# Altium schematic sheet ESPBoard.SchDoc
size A4; SheetNumber: 1; SheetTotal: 1
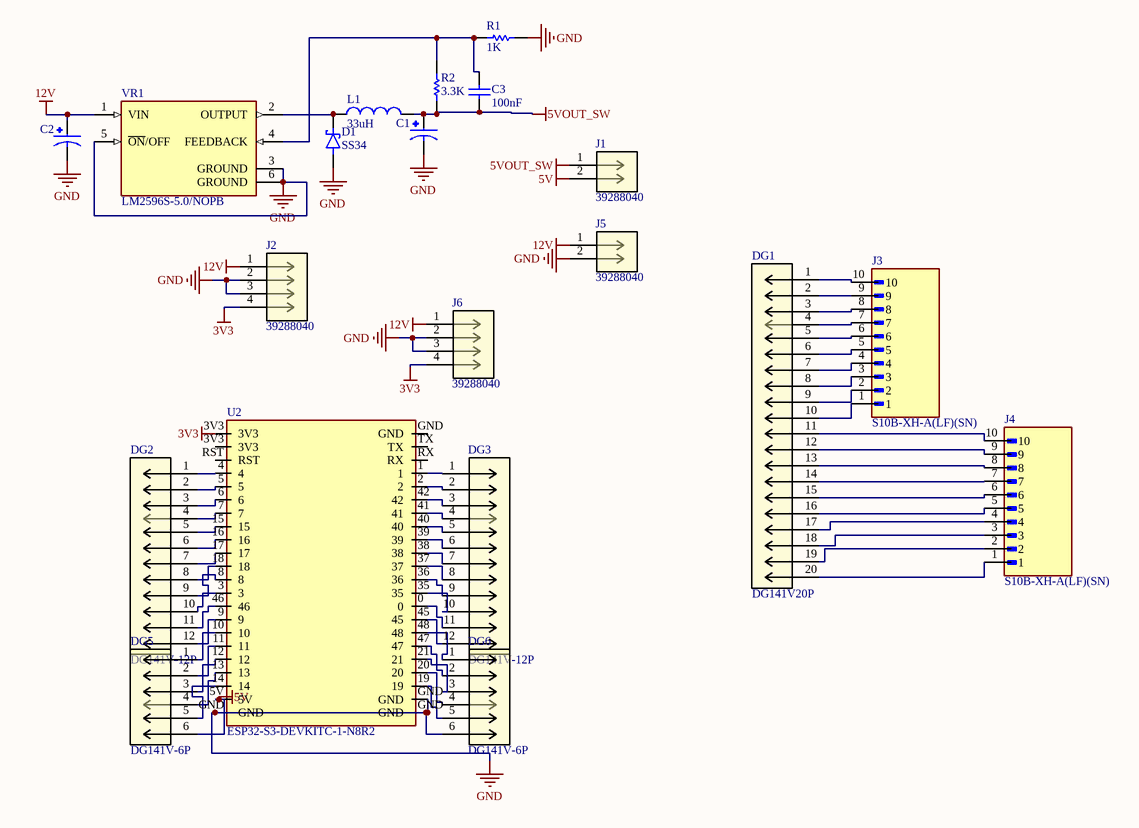
[diagram p0: ESPBoard.SchDoc]

## Parts
C1  EEUFR1V101B  [220uF]  (value not drawn)
C2  EEUFR1V101B  [100uF]  (value not drawn)
C3  value 100nF  [CAP0805R]  (hidden comment: Capacitor)
D1  SS34  [DIOM7959X265N]
DG1  DG141V20P  [141V-20P]
DG2  DG141V-12P  [141V-12P]
DG3  DG141V-12P  [141V-12P]
DG5  DG141V-6P  [141V-6P]
DG6  DG141V-6P  [141V-6P]
J1  39288040  [5566-02_MOL]
J2  39288040  [5566-04_MOL]
J3  S10B-XH-A(LF)(SN)  [JST_S10B-XH-A(LF)(SN)]
J4  S10B-XH-A(LF)(SN)  [JST_S10B-XH-A(LF)(SN)]
J5  39288040  [5566-02_MOL]
J6  39288040  [5566-04_MOL]
L1  value 33uH  [SC1280S-33uH]  (hidden comment: Inductor)
R1  value 1K  [RES0805W]  (hidden comment: Resistor)
R2  value 3.3K  [RES0805W]  (hidden comment: Resistor)
U2  ESP32-S3-DEVKITC-1-N8R2  [ESP32-S3-DEVKITC-1]
VR1  LM2596S-5.0/NOPB  [VREG_LM2596S-5.0/NOPB]

## Nets
3V3: J2.4 J6.4 U2.3V3
5V: DG5.6 J1.2 U2.5V
5VOUT_SW: C1.P C3.1 J1.1 L1.2 R2.1
12V: C2.P J2.1 J5.1 J6.1 VR1.1(VIN)
GND: C1.N C2.N D1.A DG6.6 J2.2 J2.3 J5.2 J6.2 J6.3 R1.1 U2.GND VR1.3(GROUND) VR1.5(~{ON}/OFF) VR1.6(GROUND)
NetC3_2: C3.2 R1.2 R2.2 VR1.4(FEEDBACK)
NetD1_C: D1.C(K) L1.1 VR1.2(OUTPUT)
NetDG1_1: DG1.1 J3.10
NetDG1_2: DG1.2 J3.9
NetDG1_3: DG1.3 J3.8
NetDG1_4: DG1.4 J3.7
NetDG1_5: DG1.5 J3.6
NetDG1_6: DG1.6 J3.5
NetDG1_7: DG1.7 J3.4
NetDG1_8: DG1.8 J3.3
NetDG1_9: DG1.9 J3.2
NetDG1_10: DG1.10 J3.1
NetDG1_11: DG1.11 J4.10
NetDG1_12: DG1.12 J4.9
NetDG1_13: DG1.13 J4.8
NetDG1_14: DG1.14 J4.7
NetDG1_15: DG1.15 J4.6
NetDG1_16: DG1.16 J4.5
NetDG1_17: DG1.17 J4.4
NetDG1_18: DG1.18 J4.3
NetDG1_19: DG1.19 J4.2
NetDG1_20: DG1.20 J4.1
NetDG2_1: DG2.1 U2.4
NetDG2_2: DG2.2 U2.5
NetDG2_3: DG2.3 U2.6
NetDG2_4: DG2.4 U2.7
NetDG2_5: DG2.5 U2.15
NetDG2_6: DG2.6 U2.16
NetDG2_7: DG2.7 U2.17
NetDG2_8: DG2.8 U2.18
NetDG2_9: DG2.9 U2.8
NetDG2_10: DG2.10 U2.3
NetDG2_11: DG2.11 U2.46
NetDG2_12: DG2.12 U2.9
NetDG3_1: DG3.1 U2.1
NetDG3_2: DG3.2 U2.2
NetDG3_3: DG3.3 U2.42
NetDG3_4: DG3.4 U2.41
NetDG3_5: DG3.5 U2.40
NetDG3_6: DG3.6 U2.39
NetDG3_7: DG3.7 U2.38
NetDG3_8: DG3.8 U2.37
NetDG3_9: DG3.9 U2.36
NetDG3_10: DG3.10 U2.35
NetDG3_11: DG3.11 U2.0
NetDG3_12: DG3.12 U2.45
NetDG5_1: DG5.1 U2.10
NetDG5_2: DG5.2 U2.11
NetDG5_3: DG5.3 U2.12
NetDG5_4: DG5.4 U2.13
NetDG5_5: DG5.5 U2.14
NetDG6_1: DG6.1 U2.48
NetDG6_2: DG6.2 U2.47
NetDG6_3: DG6.3 U2.21
NetDG6_4: DG6.4 U2.20
NetDG6_5: DG6.5 U2.19

Not connected (* = marked no-connect by the designer): U2 RST RX TX

## Library data of the parts
C1 C2 = EEUFR1V101B: AL LYTIC, RADIAL, 35VDC, 100UF; MF: Panasonic; MP: EEUFR1V101B; Value: *; Check_prices: https://www.snapeda.com/parts/EEUFR1V101B/Panasonic/view-part/5790218/?ref=eda; SnapEDA_Link: https://www.snapeda.com/parts/EEUFR1V101B/Panasonic/view-part/5790218/?ref=snap; Price: None; Availability: In Stock; Package: RADIAL-2 Panasonic
C3 = Capacitor: SimulationGenericComponent: True
D1 = SS34: Diode Schottky 40 V 3A Surface Mount SMC (DO-214AB); MF: onsemi; SnapEDA_Link: https://www.snapeda.com/parts/SS34/Onsemi/view-part/?ref=snap; Package: SMC-2 ON Semiconductor; Value: *; MP: SS34; Check_prices: https://www.snapeda.com/parts/SS34/Onsemi/view-part/?ref=eda
DG1 = DG141V-20P
J1 J5 = 5566-02A: Mini-Fit Jr. Vertical Header, 4.20mm Pitch, Dual Row, 2 Circuits, without Snap-in Plastic Peg PCB Lock, Tin, Natural; Manufacturer_Name: Molex Connector Corporation; Copyright: Copyright (C) 2025 Ultra Librarian. All rights reserved.; Manufacturer_Part_Number: 39288040; RefDes: RefDes; Type: Type
J2 J6 = 5566-04A: Mini-Fit Jr. Vertical Header, 4.20mm Pitch, Dual Row, 4 Circuits, without Snap-in Plastic Peg PCB Lock, Tin, Natural; Manufacturer_Name: Molex Connector Corporation; Copyright: Copyright (C) 2025 Ultra Librarian. All rights reserved.; Manufacturer_Part_Number: 39288040; RefDes: RefDes; Type: Type
L1 = Inductor: SimulationGenericComponent: True
R1 R2 = Resistor: TC1: 0; SimulationGenericComponent: True; TC2: 0
U2 = ESP32-S3-DEVKITC-1-N8R2: WiFi Development Tools - 802.11 (Engineering Samples Only) ESP32-S3 General-Purpose Development Board, ESP32-S3-WROOM-1-N8R2, with Pin Header; MF: Espressif Systems; SnapEDA_Link: https://www.snapeda.com/parts/ESP32-S3-DEVKITC-1-N8R2/Espressif+Systems/view-part/?ref=snap; Package: None; Value: *; MP: ESP32-S3-DEVKITC-1-N8R2; Check_prices: https://www.snapeda.com/parts/ESP32-S3-DEVKITC-1-N8R2/Espressif+Systems/view-part/?ref=eda
VR1 = LM2596S-5.0/NOPB: SIMPLE SWITCHERÂ® 4.5V to 40V, 3A Low Component Count Step-Down Regulator 5-DDPAK/TO-263; MF: Texas Instruments; SnapEDA_Link: https://www.snapeda.com/parts/LM2596S-5.0/Texas+Instruments/view-part/?ref=snap; Package: TO-263-5 Texas Instruments; Value: *; MP: LM2596S-5.0; Check_prices: https://www.snapeda.com/parts/LM2596S-5.0/Texas+Instruments/view-part/?ref=eda
J3 J4 = S10B-XH-A(LF)(SN): Package: None; Price: None; Value: *; MP: S10B-XH-A(LF)(SN); Availability: Unavailable